# Altium schematic sheet Sheet1.SCHDOC
size 297 x 209 mm; SheetNumber: 1; SheetTotal: 1; DocumentName: Sheet1.SCHDOC
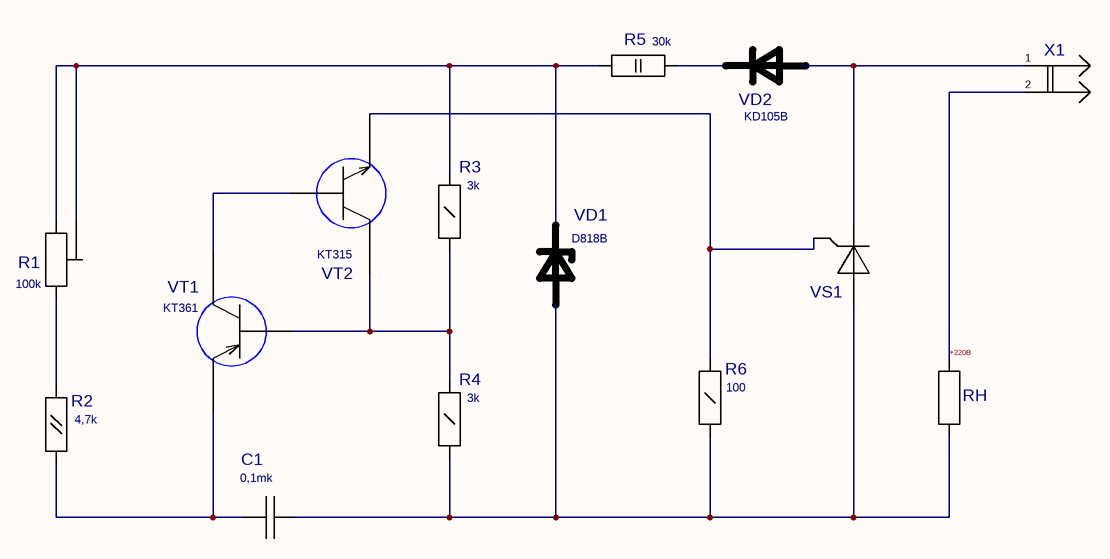
[diagram p0: Sheet1.SCHDOC]

## Parts
C1  value 0,1mk  [K73-11-160В-4,7МКФ]  (hidden comment: К73-11-160В-4,7МКФ)
R1  value 100k  [3006P]  (hidden comment: 3006W)
R2  value 4,7k  [C2-33H-0.125W]  (hidden comment: C2-33H-0.125W_OLD_UGO)
R3  value 3k  [C2-33H-0.25W]  (hidden comment: C2-33H-0.25W_OLD_UGO)
R4  value 3k  [C2-33H-0.25W]  (hidden comment: C2-33H-0.25W_OLD_UGO)
R5  value 30k  [C2-33H-2W]  (hidden comment: C2-33H-2W_OLD_UGO)
R6  value 100  [C2-33H-0.25W]  (hidden comment: C2-33H-0.25W_OLD_UGO)
RH  C2-33Н-0.125W_10ММ  [C2-33H-0.125W_10MM]  (value not drawn)
VD1  value D818B  [Д818]  (hidden comment: Д818А)
VD2  value KD105B  [КД105]  (hidden comment: КД105Б)
VS1  KU202R  [KU202R]  (value not drawn)
VT1  value KT361  [KT13]  (hidden comment: КТ361А)
VT2  value KT315  [KT13]  (hidden comment: КТ315А)
X1  PW15-2M  [PW15-2M]  (value not drawn)

## Nets
+220B: RH.2 X1.2(I/O2)
NetC1_1: C1.1 R2.1 VT1.1(E)
NetC1_2: C1.2 R4.1 R6.1 RH.1 VD1.A VS1.1(I/OA)
NetR1_1: R1.1 R2.2
NetR1_2: R1.2 R1.3 R3.2 R5.1 VD1.K
NetR3_1: R3.1 R4.2 VT1.2(B) VT2.3(K)
NetR5_2: R5.2 VD2.K
NetR6_2: R6.2 VS1.3(IN) VT2.1(E)
NetVD2_A: VD2.A VS1.2(I/OB) X1.1(I/O1)
NetVT1_3: VT1.3(K) VT2.2(B)

Not connected (* = marked no-connect by the designer): VS1 4 5

## Library data of the parts
R2 = C2-33H-0.125W_OLD_UGO: Autor: pcbdesigner.ru
R3 R4 R6 = C2-33H-0.25W_OLD_UGO: Autor: pcbdesigner.ru
R5 = C2-33H-2W_OLD_UGO: Autor: pcbdesigner.ru
RH = C2-33Н-0.125W_10ММ: Value: *
VS1 = KU202R: Value: *
X1 = PW15-2M: Value: *